# Altium schematic sheet warpcore.SchDoc
size A4
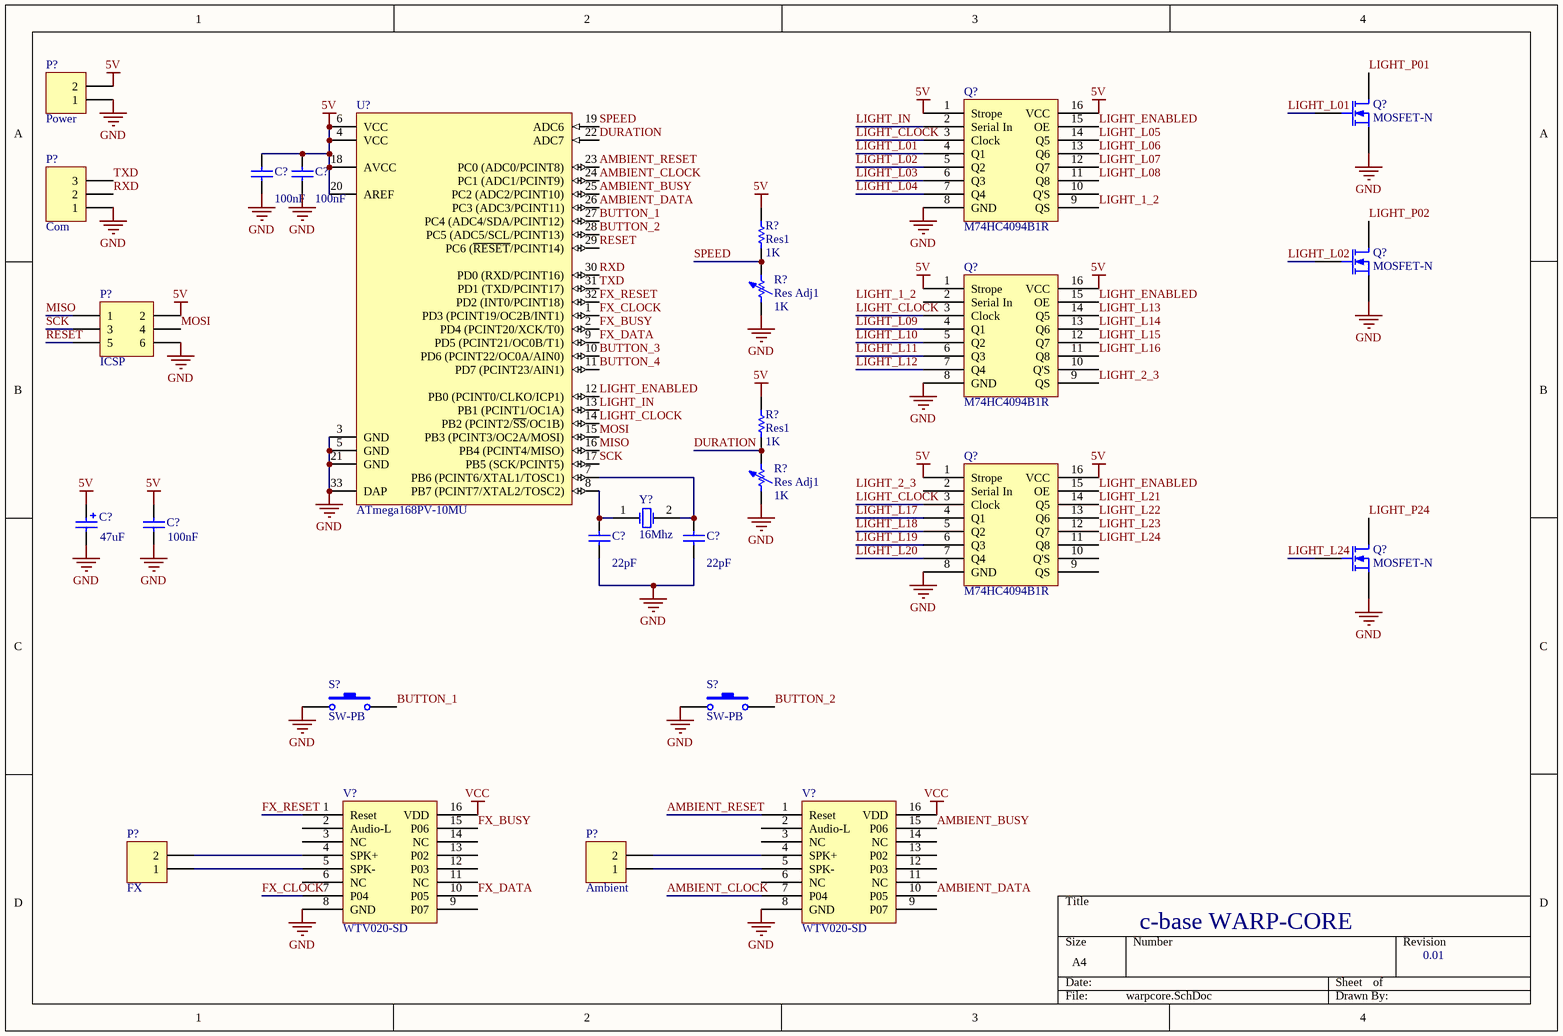
[diagram p0: warpcore.SchDoc]

## Parts
(Parts that share a designator on the sheet are numbered #1, #2 ... from top to bottom, then left to right.)
C?#1  value 100nF  [RAD-0.3]  (hidden comment: Cap)
C?#2  value 100nF  [RAD-0.3]  (hidden comment: Cap)
C?#3  value 47uF  [POLAR0.8]  (hidden comment: Cap Pol2)
C?#4  value 100nF  [RAD-0.3]  (hidden comment: Cap)
C?#5  value 22pF  [RAD-0.3]  (hidden comment: Cap)
C?#6  value 22pF  [RAD-0.3]  (hidden comment: Cap)
P?#1  Power  [HDR1X2]
P?#2  Com  [HDR1X3]
P?#3  ICSP  [HDR2X3]
P?#4  FX  [HDR1X2]
P?#5  Ambient  [HDR1X2]
Q?#1  MOSFET-N  [E3]
Q?#2  M74HC4094B1R
Q?#3  MOSFET-N  [E3]
Q?#4  M74HC4094B1R
Q?#5  M74HC4094B1R
Q?#6  MOSFET-N  [E3]
R?#1  Res1  value 1K  [AXIAL-0.3]
R?#2  Res Adj1  value 1K  [AXIAL-0.7]
R?#3  Res1  value 1K  [AXIAL-0.3]
R?#4  Res Adj1  value 1K  [AXIAL-0.7]
S?#1  SW-PB  [SPST-2]
S?#2  SW-PB  [SPST-2]
U?  ATmega168PV-10MU  [32M1-A_N]
V?#1  WTV020-SD
V?#2  WTV020-SD
Y?  16Mhz  [R38]

## Nets
5V: C?#1.2 C?#2.2 C?#3.1 C?#4.2 P?#1.2 P?#3.2 Q?#2.1(Strope) Q?#2.16(VCC) Q?#4.1(Strope) Q?#4.16(VCC) Q?#5.1(Strope) Q?#5.16(VCC) R?#1.2 R?#3.2 U?.4(VCC) U?.6(VCC) U?.18(AVCC) U?.20(AREF)
GND: C?#1.1 C?#2.1 C?#3.2 C?#4.1 C?#5.1 C?#6.1 P?#1.1 P?#2.1 P?#3.6 Q?#1.3(S) Q?#2.8(GND) Q?#3.3(S) Q?#4.8(GND) Q?#5.8(GND) Q?#6.3(S) R?#2.1 R?#4.1 S?#1.1 S?#2.1 U?.3(GND) U?.5(GND) U?.21(GND) U?.33(DAP) V?#1.8(GND) V?#2.8(GND)
VCC: V?#1.16(VDD) V?#2.16(VDD)
AMBIENT_BUSY: U?.25(PC2_(ADC2/PCINT10)) V?#2.15(P06)
AMBIENT_CLOCK: U?.24(PC1_(ADC1/PCINT9)) V?#2.7(P04)
AMBIENT_DATA: U?.26(PC3_(ADC3/PCINT11)) V?#2.10(P05)
AMBIENT_RESET: U?.23(PC0_(ADC0/PCINT8)) V?#2.1(Reset)
BUTTON_1: S?#1.2 U?.27(PC4_(ADC4/SDA/PCINT12))
BUTTON_2: S?#2.2 U?.28(PC5_(ADC5/SCL/PCINT13))
BUTTON_3: U?.10(PD6_(PCINT22/OC0A/AIN0))
BUTTON_4: U?.11(PD7_(PCINT23/AIN1))
DURATION: R?#3.1 R?#4.2 U?.22(ADC7)
FX_BUSY: U?.2(PD4_(PCINT20/XCK/T0)) V?#1.15(P06)
FX_CLOCK: U?.1(PD3_(PCINT19/OC2B/INT1)) V?#1.7(P04)
FX_DATA: U?.9(PD5_(PCINT21/OC0B/T1)) V?#1.10(P05)
FX_RESET: U?.32(PD2_(INT0/PCINT18)) V?#1.1(Reset)
LIGHT_1_2: Q?#2.9(QS)
LIGHT_2_3: Q?#4.9(QS)
LIGHT_CLOCK: Q?#2.3(Clock) Q?#4.3(Clock) Q?#5.3(Clock) U?.14(PB2_(PCINT2/~{SS}/OC1B))
LIGHT_ENABLED: Q?#2.15(OE) Q?#4.15(OE) Q?#5.15(OE) U?.12(PB0_(PCINT0/CLKO/ICP1))
LIGHT_IN: Q?#2.2(Serial_In) U?.13(PB1_(PCINT1/OC1A))
LIGHT_L01: Q?#1.2(G) Q?#2.4(Q1)
LIGHT_L02: Q?#2.5(Q2) Q?#3.2(G)
LIGHT_L03: Q?#2.6(Q3)
LIGHT_L04: Q?#2.7(Q4)
LIGHT_L05: Q?#2.14(Q5)
LIGHT_L06: Q?#2.13(Q6)
LIGHT_L07: Q?#2.12(Q7)
LIGHT_L08: Q?#2.11(Q8)
LIGHT_L09: Q?#4.4(Q1)
LIGHT_L10: Q?#4.5(Q2)
LIGHT_L11: Q?#4.6(Q3)
LIGHT_L12: Q?#4.7(Q4)
LIGHT_L13: Q?#4.14(Q5)
LIGHT_L14: Q?#4.13(Q6)
LIGHT_L15: Q?#4.12(Q7)
LIGHT_L16: Q?#4.11(Q8)
LIGHT_L17: Q?#5.4(Q1)
LIGHT_L18: Q?#5.5(Q2)
LIGHT_L19: Q?#5.6(Q3)
LIGHT_L20: Q?#5.7(Q4)
LIGHT_L21: Q?#5.14(Q5)
LIGHT_L22: Q?#5.13(Q6)
LIGHT_L23: Q?#5.12(Q7)
LIGHT_L24: Q?#5.11(Q8) Q?#6.2(G)
LIGHT_P01: Q?#1.1(D)
LIGHT_P02: Q?#3.1(D)
LIGHT_P24: Q?#6.1(D)
MISO: P?#3.1 U?.16(PB4_(PCINT4/MISO))
MOSI: P?#3.4 U?.15(PB3_(PCINT3/OC2A/MOSI))
RESET: P?#3.5 U?.29(PC6_(~{RESET}/PCINT14))
RXD: P?#2.2 U?.30(PD0_(RXD/PCINT16))
SCK: P?#3.3 U?.17(PB5_(SCK/PCINT5))
SPEED: R?#1.1 R?#2.2 U?.19(ADC6)
TXD: P?#2.3 U?.31(PD1_(TXD/PCINT17))
NetC?#5_2: C?#5.2 U?.8(PB7_(PCINT7/XTAL2/TOSC2)) Y?.1(OSC1)
NetC?#6_2: C?#6.2 U?.7(PB6_(PCINT6/XTAL1/TOSC1)) Y?.2(OSC2)
NetP?#4_1: P?#4.1 V?#1.5(SPK-)
NetP?#4_2: P?#4.2 V?#1.4(SPK+)
NetP?#5_1: P?#5.1 V?#2.5(SPK-)
NetP?#5_2: P?#5.2 V?#2.4(SPK+)

Not connected (* = marked no-connect by the designer): Q?#2 10(Q'S); Q?#4 2(Serial_In) 10(Q'S); Q?#5 2(Serial_In) 9(QS) 10(Q'S); V?#1 2(Audio-L) 3(NC) 6(NC) 9(P07) 11(NC) 12(P03) 13(P02) 14(NC); V?#2 2(Audio-L) 3(NC) 6(NC) 9(P07) 11(NC) 12(P03) 13(P02) 14(NC)

## Notes on the sheet
- c-base WARP-CORE
- 0.01
- Labels drawn without touching a wire or pin: LIGHT_1_2, LIGHT_2_3

## Library data of the parts
C?#1 C?#2 C?#4-C?#6 = Cap: Capacitor; Published: 8-Jun-2000; LatestRevisionDate: 17-Jul-2002; LatestRevisionNote: Re-released for DXP Platform.; PackageReference: RAD-0.3; Publisher: Altium Limited; PackageDescription: Radial Cap, Thru-Hole; 2 Leads; 0.3 in Pin Spacing
C?#3 = Cap Pol2: Polarized Capacitor (Axial); Published: 8-Jun-2000; LatestRevisionDate: 17-Jul-2002; LatestRevisionNote: Re-released for DXP Platform.; PackageReference: POLAR0.8; Publisher: Altium Limited; PackageDescription: Polarized Capacitor; 2 Leads
P?#1 P?#4 P?#5 = Header 2: Header, 2-Pin; LatestRevisionDate: 17-Jul-2002; LatestRevisionNote: Re-released for DXP Platform.; Publisher: Altium Limited
P?#2 = Header 3: Header, 3-Pin; LatestRevisionDate: 17-Jul-2002; LatestRevisionNote: Re-released for DXP Platform.; Publisher: Altium Limited
P?#3 = Header 3X2: Header, 3-Pin, Dual row; LatestRevisionDate: 17-Jul-2002; LatestRevisionNote: Re-released for DXP Platform.; Publisher: Altium Limited
Q?#1 Q?#3 Q?#6 = MOSFET-N: N-Channel MOSFET; Published: 8-Jun-2000; LatestRevisionDate: 17-Jul-2002; LatestRevisionNote: Re-released for DXP Platform.; PackageVersion: 1995/1996; PackageReference: E3; Publisher: Altium Limited; PackageDescription: TO, Flat Index; 3 In-Line, Axial Leads; Body Dia. 4.6mm; Lead Dia. 0.5 mm (max)
R?#1 R?#3 = Res1: Resistor; Published: 8-Jun-2000; LatestRevisionDate: 17-Jul-2002; LatestRevisionNote: Re-released for DXP Platform.; PackageReference: AXIAL-0.3; Publisher: Altium Limited; PackageDescription: Axial Device, Thru-Hole; 2 Leads; 0.3 in Pin Spacing
R?#2 R?#4 = Res Adj1: Variable Resistor; Set Position: 0.5; Published: 8-Jun-2000; LatestRevisionDate: 17-Jul-2002; LatestRevisionNote: Re-released for DXP Platform.; PackageReference: AXIAL-0.7; Publisher: Altium Limited; PackageDescription: Axial Device, Thru-Hole; 2 Leads; 0.7 in Pin Spacing
S?#1 S?#2 = SW-PB: Switch; Published: 24-Mar-1999; LatestRevisionDate: 17-Jul-2002; LatestRevisionNote: Re-released for DXP Platform.; PackageReference: SPST-2; Publisher: Altium Limited; PackageDescription: Switch; 2 Leads
U? = CMP-0095-00434-1: 8-bit AVR Microcontroller, picoPower, 1.8-5.5V, 16KB Flash, 512 Bytes EEPROM, 1KB SRAM, 32-pin MLF, Industrial Grade (-40°C to 85°C); ComponentLink2Description: ATmega48P/88P/168P Datasheet; PackageVersion: revE, May-2006; ComponentLink1Description: Manufacturer URL; ComponentLink3URL: http://www.atmel.com/dyn/resources/prod_documents/8025s.pdf; PackageReference: 32M1-A; PackageDescription: 32-Pin Micro Lead Frame Package (MLF),  5 x 5 x 1.0 mm Body, Pitch 0.50 mm, 3.10mm Exposed Pad; ComponentLink2URL: http://www.atmel.com/dyn/resources/prod_documents/doc8025.pdf; ComponentLink3Description: ATmega48P/88P/168P Summary; Code_JEDEC: MO-220-VHHD-2; DatasheetVersion: revM Jun-2011; ComponentLink1URL: http://www.atmel.com/
V?#1 V?#2 = Voice Module
Y? = XTAL: Crystal Oscillator; Published: 8-Jun-2000; LatestRevisionDate: 17-Jul-2002; LatestRevisionNote: Re-released for DXP Platform.; PackageReference: R38; Publisher: Altium Limited; PackageDescription: Crystal, Thru-Hole; 2 Leads; Body 3.1 x 8.2 mm (Dia.xH)